# EAGLE design Rover Sensor Board (EAGLE 9.6.0)
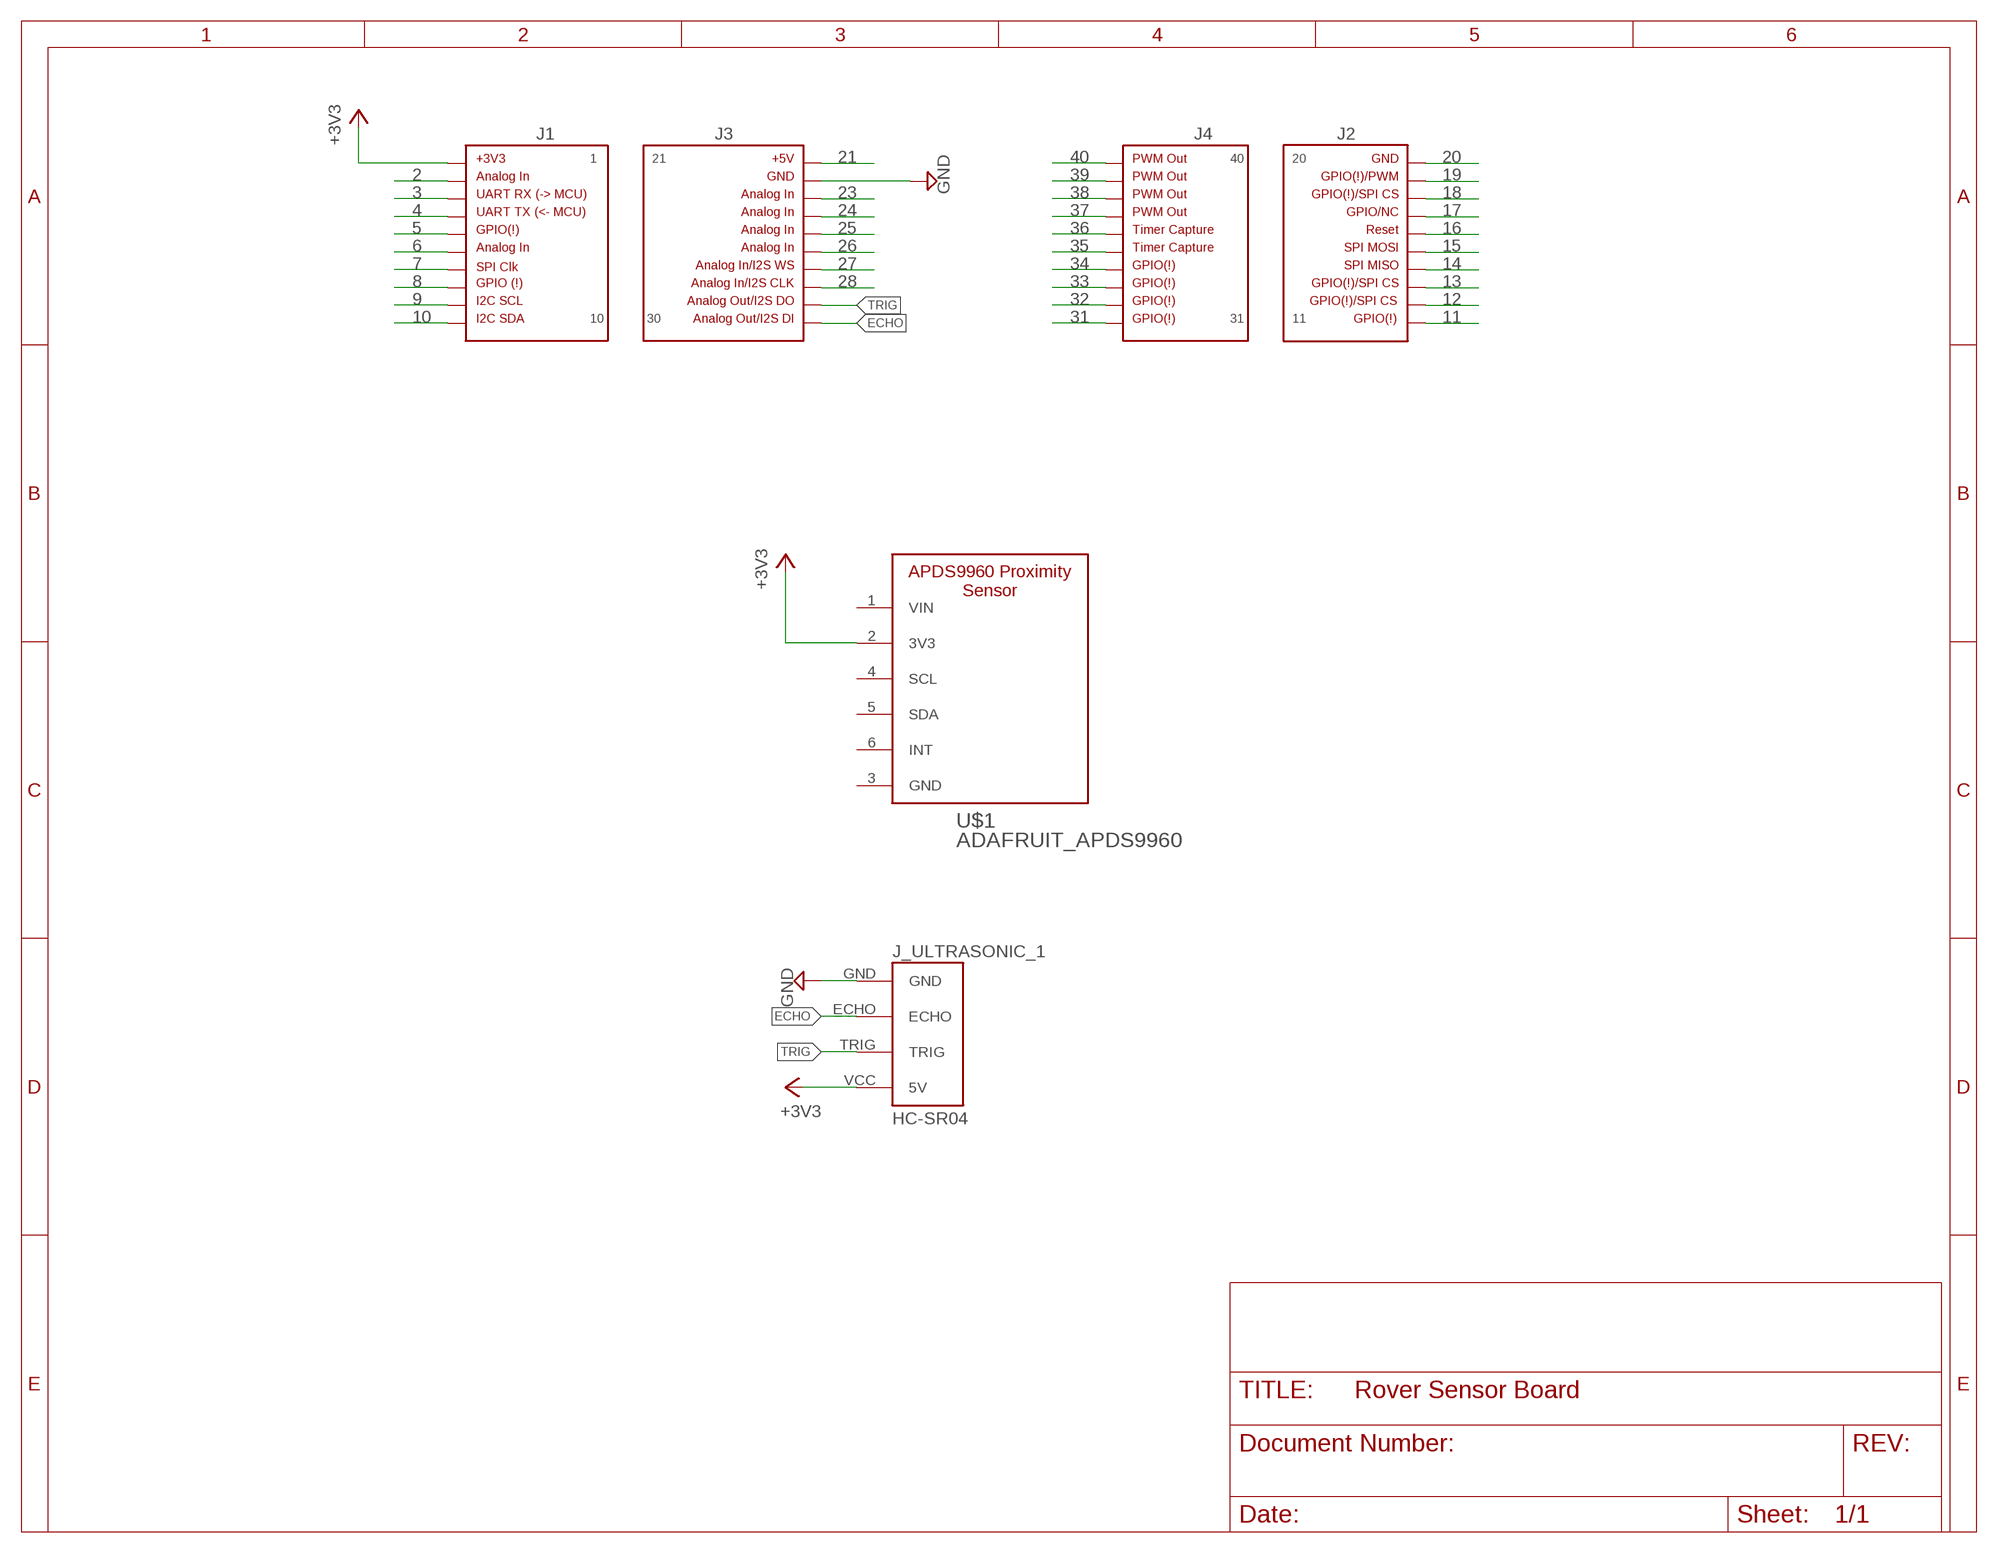
[diagram p0: schematic, sheet 1]

## Parts
J1  HEADER1X10-J1SILK_LABELS  [J1]
J2  HEADER1X10-J2SILK_LABELS  [J2]
J3  HEADER1X10-J3NOSILK  [1X10-J3]
J4  HEADER1X10-J4SILK_LABELS  [J4]
J_ULTRASONIC_1  HC-SR04  [HC-SR04_FOOTPRINT]
U$1  ADAFRUIT_APDS9960  [ADAFRUIT_APDS9960]

## Nets
2: J1.2
3: J1.3
4: J1.4
5: J1.5
6: J1.6
7: J1.7
8: J1.8
9: J1.9
10: J1.10
11: J2.11
12: J2.12
13: J2.13
14: J2.14
15: J2.15
16: J2.16
17: J2.17
18: J2.18
19: J2.19
20: J2.20
21: J3.21
23: J3.23
24: J3.24
25: J3.25
26: J3.26
27: J3.27
28: J3.28
31: J4.31
32: J4.32
33: J4.33
34: J4.34
35: J4.35
36: J4.36
37: J4.37
38: J4.38
39: J4.39
40: J4.40
+3V3: J1.1 J_ULTRASONIC_1.VCC(5V) U$1.2(3V3)
ECHO: J3.30 J_ULTRASONIC_1.ECHO
GND: J3.22 J_ULTRASONIC_1.GND
TRIG: J3.29 J_ULTRASONIC_1.TRIG
Unconnected: U$1.1(VIN) U$1.3(GND) U$1.4(SCL) U$1.5(SDA) U$1.6(INT)

## Library data of the parts
J1 = Rover Library:HEADER1X10-J1
J2 = Rover Library:HEADER1X10-J2
J3 = Rover Library:HEADER1X10-J3
J4 = Rover Library:HEADER1X10-J4
J_ULTRASONIC_1 = Rover Library:HC-SR04: Ultrasonic Sensor HC-SR04
U$1 = Rover Library:ADAFRUIT_APDS9960

## Board
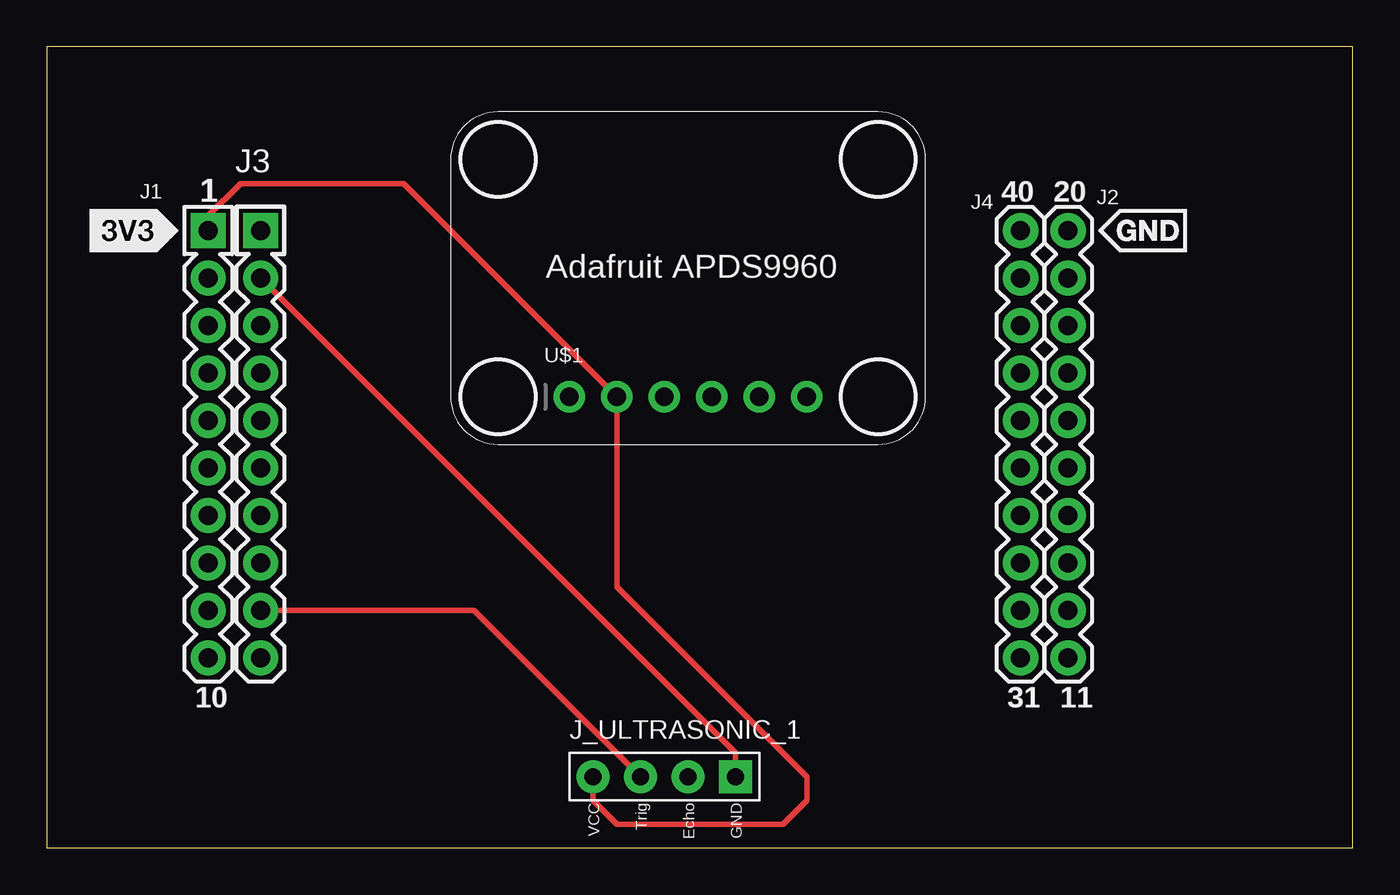
[diagram p1: board, top side]
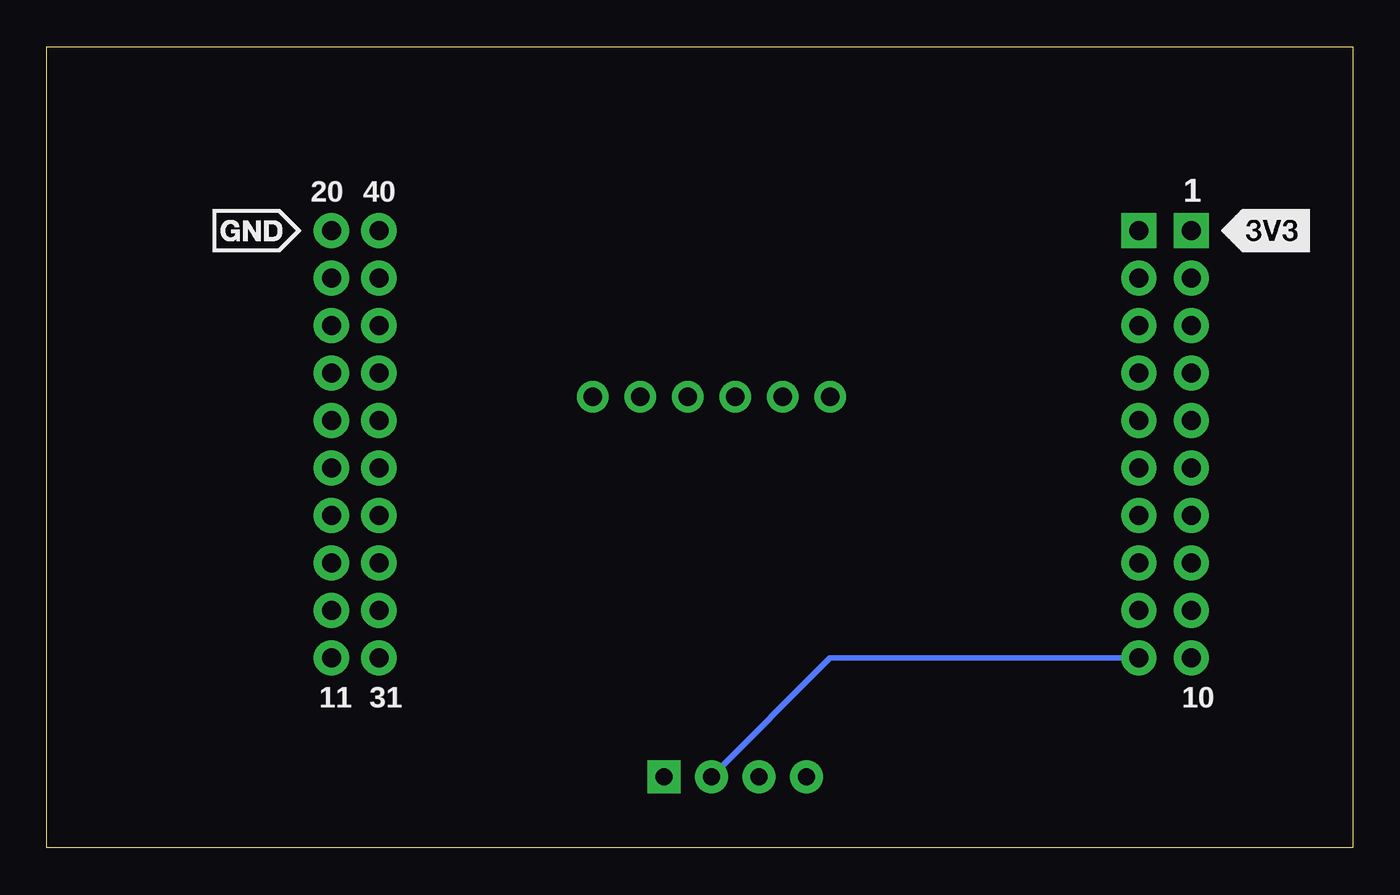
[diagram p2: board, bottom side, seen from below]

Size 69.83 x 42.85 mm. Coordinates in mm from the lower left corner, seen from the top.
Outline: 0,0 69.83,0 69.83,42.85 0,42.85 0,0
Copper layers (1*16): Top 0.035mm / dielectric 1.5mm / Bottom 0.035mm
Design rules "default": minimum track width 6mil, minimum drill 0.35mm, track to track 6mil, track to pad 6mil, pad to pad 6mil, via to via 6mil, smd to smd 6mil, copper to edge 40mil, drill to drill 6mil, minimum pad ring 10mil, minimum via ring 8mil, stop-mask expansion 4mil, vias tented up to drill 0mil, thermal gap 10mil

### Footprints (pad centres in the part's own frame; a part is rotated, then mirrored left to right if it is on the bottom)
J1 = drill 1.016 pad 1.88 square: 1 0,11.43 | drill 1.016 pad 1.88: 2 0,8.89; 3 0,6.35; 4 0,3.81; 5 0,1.27; 6 0,-1.27; 7 0,-3.81; 8 0,-6.35; 9 0,-8.89; 10 0,-11.43
J2 = drill 1.016 pad 1.88: 11 0,-11.43; 12 0,-8.89; 13 0,-6.35; 14 0,-3.81; 15 0,-1.27; 16 0,1.27; 17 0,3.81; 18 0,6.35; 19 0,8.89; 20 0,11.43
1X10-J3 = drill 1.016 pad 1.88 square: 21 0,10.16 | drill 1.016 pad 1.88: 22 0,7.62; 23 0,5.08; 24 0,2.54; 25 0,0; 26 0,-2.54; 27 0,-5.08; 28 0,-7.62; 29 0,-10.16; 30 0,-12.7
J4 = drill 1.016 pad 1.88: 31 0,-11.43; 32 0,-8.89; 33 0,-6.35; 34 0,-3.81; 35 0,-1.27; 36 0,1.27; 37 0,3.81; 38 0,6.35; 39 0,8.89; 40 0,11.43
HC-SR04_FOOTPRINT = drill 0.9 pad 1.778: ECHO 0,1.27; TRIG 0,-1.27; VCC 0,-3.81 | drill 0.9 pad 1.778 square: GND 0,3.81
ADAFRUIT_APDS9960 = drill 1 pad 1.676: 1 6.35,2.54; 2 8.89,2.54; 3 11.43,2.54; 4 13.97,2.54; 5 16.51,2.54; 6 19.05,2.54

### Placement (x,y rotation side)
J1  8.64,21.59 0 top
J2  54.61,21.59 0 top
J3  11.43,22.86 0 top
J4  52.07,21.59 0 top
J_ULTRASONIC_1  33.02,3.81 270 top
U$1  21.59,21.59 0 top

### Tracks (layer width: path | path; a pad name or v marks a point on that pad's centre or on a via)
+3V3
  Top 0.305: J1.1 8.64,33.81 10.36,35.53 19.07,35.53 U$1.2 30.48,13.97 40.64,3.81 40.64,2.54 39.37,1.27 30.48,1.27 29.21,2.54 J_ULTRASONIC_1.VCC
ECHO
  Bottom 0.305: J_ULTRASONIC_1.ECHO 27.94,10.16 J3.30
GND
  Top 0.305: J3.22 36.83,5.08 J_ULTRASONIC_1.GND
TRIG
  Top 0.305: J_ULTRASONIC_1.TRIG 22.86,12.7 J3.29